# EAGLE design TCGaugeAmplifier (EAGLE 9.6.2)
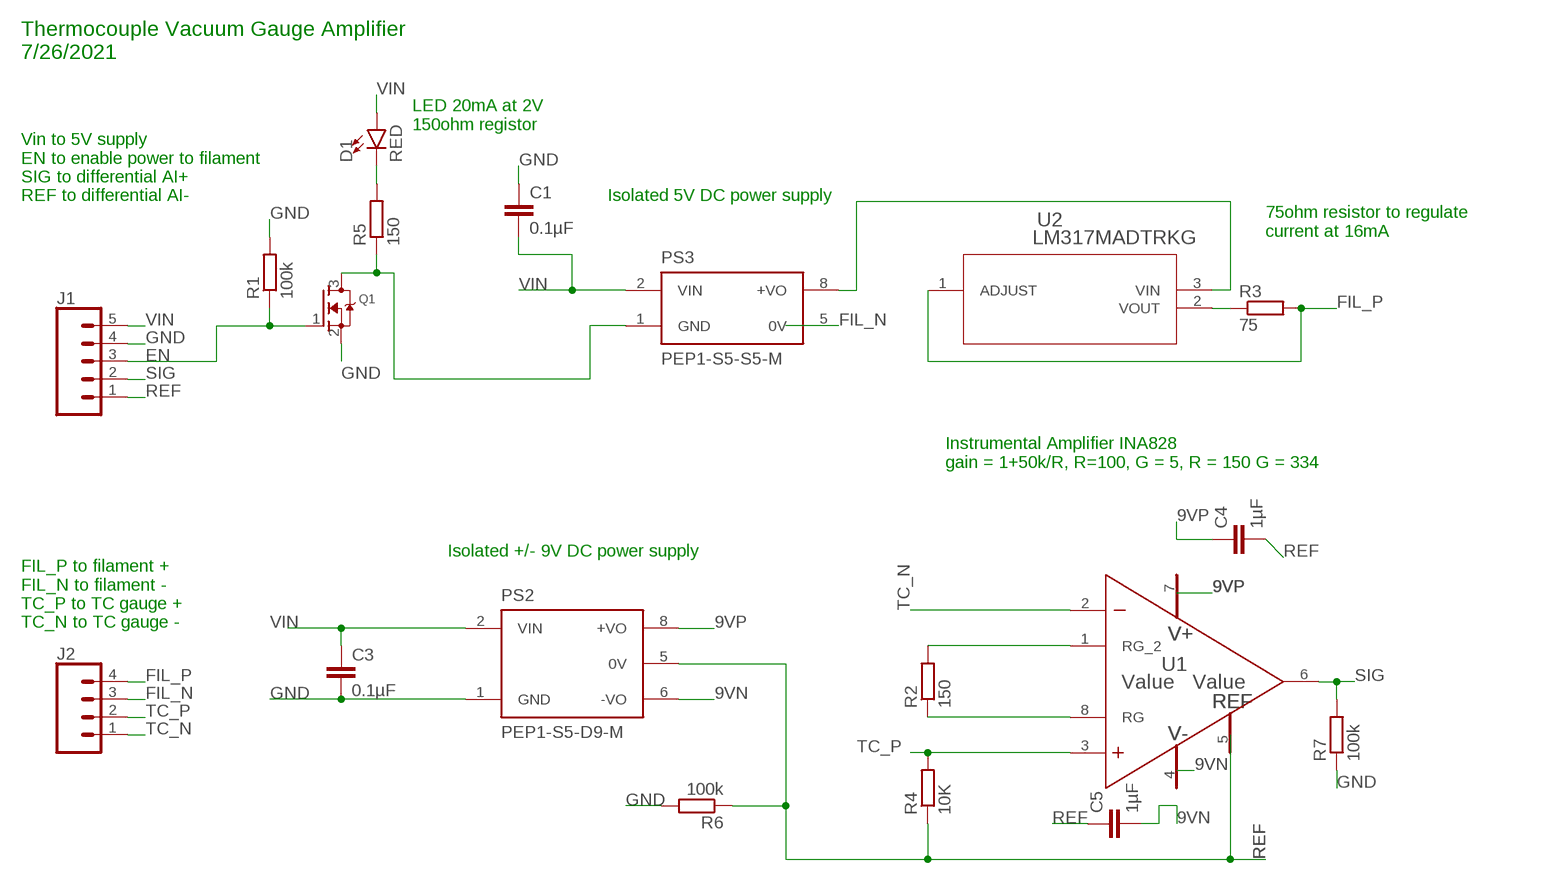
[diagram p0: schematic, sheet 1]

## Parts
C1  0.1µF  0.33UF/330NF-0805-50V-10%  [0805]
C3  0.1µF  0.33UF/330NF-0805-50V-10%  [0805]
C4  1µF  0.33UF/330NF-0805-50V-10%  [0805]
C5  1µF  0.33UF/330NF-0805-50V-10%  [0805]
D1  RED  LED-RED0603  [LED-0603]
J1  CONN_05  [1X05]
J2  CONN_04  [1X04]
PS2  PEP1-S5-D9-M  [CONV_PEP1-S5-D9-M]
PS3  PEP1-S5-S5-M  [CONV_PEP1-S5-S5-M]
Q1  MOSFET-NREFLOW  [SOT23]
R1  100k  R-EU_R0805  [R0805]
R2  150  R-EU_R0805  [R0805]
R3  75  R-EU_R0805  [R0805]
R4  10K  R-EU_R0805  [R0805]
R5  150  R-EU_R0805  [R0805]
R6  100k  R-EU_R0805  [R0805]
R7  100k  R-EU_R0805  [R0805]
U1  Value  INA828IDR  [D0008A_N]
U2  LM317MADTRKG  [DPAK-3_ONS]

## Nets
9VN: C5.2 PS2.6(-VO) U1.4(V-)
9VP: C4.1 PS2.8(+VO) U1.7(V+)
EN: J1.3 Q1.1(G) R1.1
FIL_N: J2.3 PS3.5(0V)
FIL_P: J2.4 R3.2 U2.1(ADJUST)
GND: C1.1 C3.2 J1.4 PS2.1(GND) Q1.2(S) R1.2 R6.2 R7.1
N$1: R2.2 U1.1(RG_2)
N$2: R2.1 U1.8(RG)
N$3: PS3.8(+VO) U2.3(VIN)
N$4: R3.1 U2.2(VOUT)
N$7: D1.C R5.2
N$8: PS3.1(GND) Q1.3(D) R5.1
REF: C4.2 C5.1 J1.1 PS2.5(0V) R4.1 R6.1 U1.5(REF)
SIG: J1.2 R7.2 U1.6(OUT)
TC_N: J2.1 U1.2(IN-)
TC_P: J2.2 R4.2 U1.3(IN+)
VIN: C1.2 C3.1 D1.A J1.5 PS2.2(VIN) PS3.2(VIN)

## Notes on the sheet
- Thermocouple Vacuum Gauge Amplifier
  7/26/2021
- LED 20mA at 2V
  150ohm registor
- Vin to 5V supply
  EN to enable power to filament
  SIG to differential AI+
  REF to differential AI-
- Isolated 5V DC power supply
- 75ohm resistor to regulate 
  current at 16mA
- Instrumental Amplifier INA828
  gain = 1+50k/R, R=100, G = 5, R = 150 G = 334
- Isolated +/- 9V DC power supply
- FIL_P to filament +
  FIL_N to filament -
  TC_P to TC gauge +
  TC_N to TC gauge -

## Library data of the parts
C1 C3-C5 = SparkFun-Capacitors:0.33UF/330NF: 0.33µF/330nF ceramic capacitors A capacitor is a passive two-terminal electrical component used to store electrical energy temporarily in an electric field.; PROD_ID: CAP-08469; VALUE: 0.33µF
D1 = SparkFun-LED:LED-RED: Red SMD LED Used in manufacturing of most products at SparkFun Packages: 0603 - SMD 0603 package [Product Link] <http://docs.avagotech.com/docs/AV02-0551EN> 0603 SMART - SMD 0603 SMART package ( more efficient and expensive)[Product Link] <http://www.osram-os.com/Graphics/XPic2/00077099_0.pdf> 1206 - SMD1206 package [Product Link] <https://www.sparkfun.com/datasheets/DevTools/LilyPad/Q150OVS4.pdff> SparkFun Products: Pro Mini 328 -5V <https://www.sparkfun.com/products/821> RedBoard <https://www.sparkfun.com/products/12757> IOIO-OTG <https://www.sparkfun.com/products/13613>; PROD_ID: DIO-00819
J1 = SparkFun-Connectors:CONN_05: Multi connection point. Often used as Generic Header-pin footprint for 0.1 inch spaced/style header connections On any of the 0.1 inch spaced packages, you can populate with these: Break Away Headers - Straight <https://www.sparkfun.com/products/116> (PRT-00116) Break Away Male Headers - Right Angle <https://www.sparkfun.com/products/553> (PRT-00553) Female Headers <https://www.sparkfun.com/products/115> (PRT-00115) Break Away Headers - Machine Pin <https://www.sparkfun.com/products/117> (PRT-00117) Break Away Female Headers - Swiss Machine Pin <https://www.sparkfun.com/products/743> (PRT-00743) For SCREWTERMINALS and SPRING TERMINALS visit here: Screw Terimnals on SparkFun.com <https://www.sparkfun.com/search/results?term=Screw+Terminals> (5mm/3.5mm/2.54mm spacing) This device is also useful as a general connection point to wire up your design to another part of your project. Our various solder wires solder well into these plated through hole pads. Hook-Up Wire - Assortment (Stranded, 22 AWG) <https://www.sparkfun.com/products/11375> (PRT-11375) Hook-Up Wire - Assortment (Solid Core, 22 AWG) <https://www.sparkfun.com/products/11367> (PRT-11367) View the entire wire category on our website here <https://www.sparkfun.com/categories/141> Special notes: Molex polarized connector foot print use with SKU : PRT-08231 with associated crimp pins and housings. 1MM SMD Version SKU: PRT-10208
J2 = SparkFun-Connectors:CONN_04: Multi connection point. Often used as Generic Header-pin footprint for 0.1 inch spaced/style header connections On any of the 0.1 inch spaced packages, you can populate with these: Break Away Headers - Straight <https://www.sparkfun.com/products/116> (PRT-00116) Break Away Male Headers - Right Angle <https://www.sparkfun.com/products/553> (PRT-00553) Female Headers <https://www.sparkfun.com/products/115> (PRT-00115) Break Away Headers - Machine Pin <https://www.sparkfun.com/products/117> (PRT-00117) Break Away Female Headers - Swiss Machine Pin <https://www.sparkfun.com/products/743> (PRT-00743) For SCREWTERMINALS and SPRING TERMINALS visit here: Screw Terimnals on SparkFun.com <https://www.sparkfun.com/search/results?term=Screw+Terminals> (5mm/3.5mm/2.54mm spacing) This device is also useful as a general connection point to wire up your design to another part of your project. Our various solder wires solder well into these plated through hole pads. Hook-Up Wire - Assortment (Stranded, 22 AWG) <https://www.sparkfun.com/products/11375> (PRT-11375) Hook-Up Wire - Assortment (Solid Core, 22 AWG) <https://www.sparkfun.com/products/11367> (PRT-11367) View the entire wire category on our website here <https://www.sparkfun.com/categories/141> Special notes: Molex polarized connector foot print use with SKU : PRT-08231 with associated crimp pins and housings. 1MM SMD Version SKU: PRT-10208; PROD_ID: CONN-09696
PS2 = PEP1-S5-D9-M:PEP1-S5-D9-M; MANUFACTURER: CUI Inc.; MAXIMUM_PACKAGE_HEIGHT: 7.25mm; PARTREV: 1.0; STANDARD: Manufacturer Recommendations
PS3 = PEP1-S5-S5-M:PEP1-S5-S5-M; MANUFACTURER: CUI Inc.; MAXIMUM_PACKAGE_HEIGHT: 7.25mm; PARTREV: 1.0; STANDARD: Manufacturer Recommendations
Q1 = adafruit:MOSFET-N: N-Channel Mosfet 2N7002E - 60V 260mA SOT23 [Digikey: 2N7002ET1GOSTR-ND] - REEL BSH103 - 30V 850mA SOT23 [Digikey: 568-5013-1-ND]
R1-R7 = rcl:R-EU_: RESISTOR, European symbol; SPICEPREFIX: R
U1 = INA828:INA828IDR; MANUFACTURER: Texas Instruments; PARTNUMBER: INA828IDR; REFDES: RefDes; TYPE: TYPE
U2 = LM317:LM317MADTRKG: LM317; COPYRIGHT: Copyright (C) 2016 Accelerated Designs. All rights reserved; MANUFACTURER_PART_NUMBER: LM317MADTRKG; SOURCELIBRARY: ONSemi_2017-12-12_3; VENDOR: ON Semiconductor

## Board
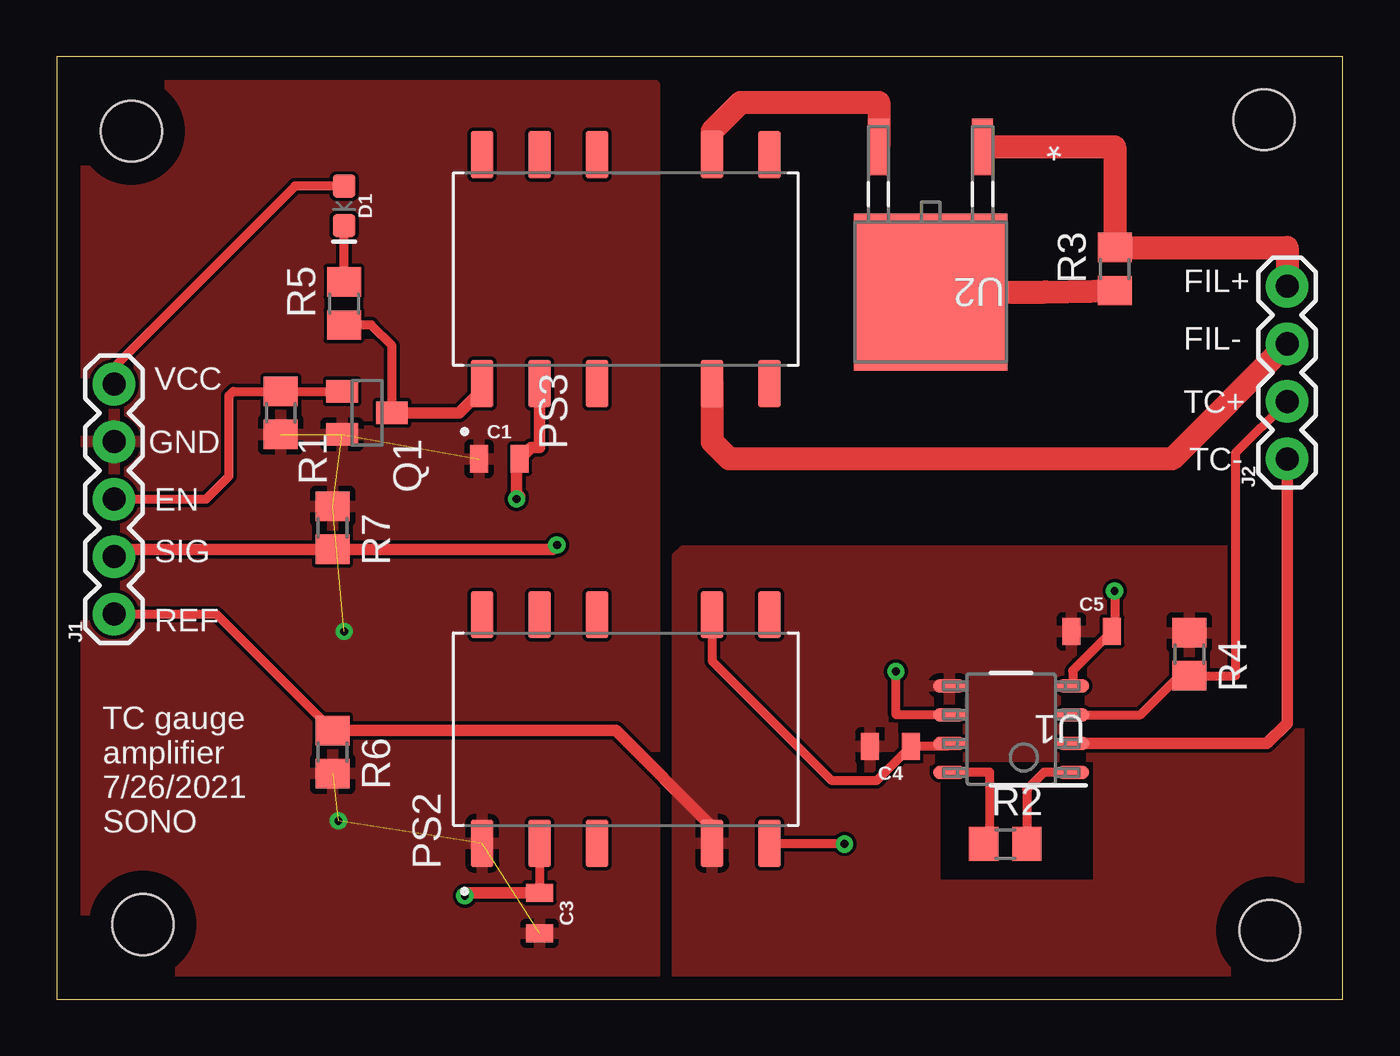
[diagram p1: board, top side]
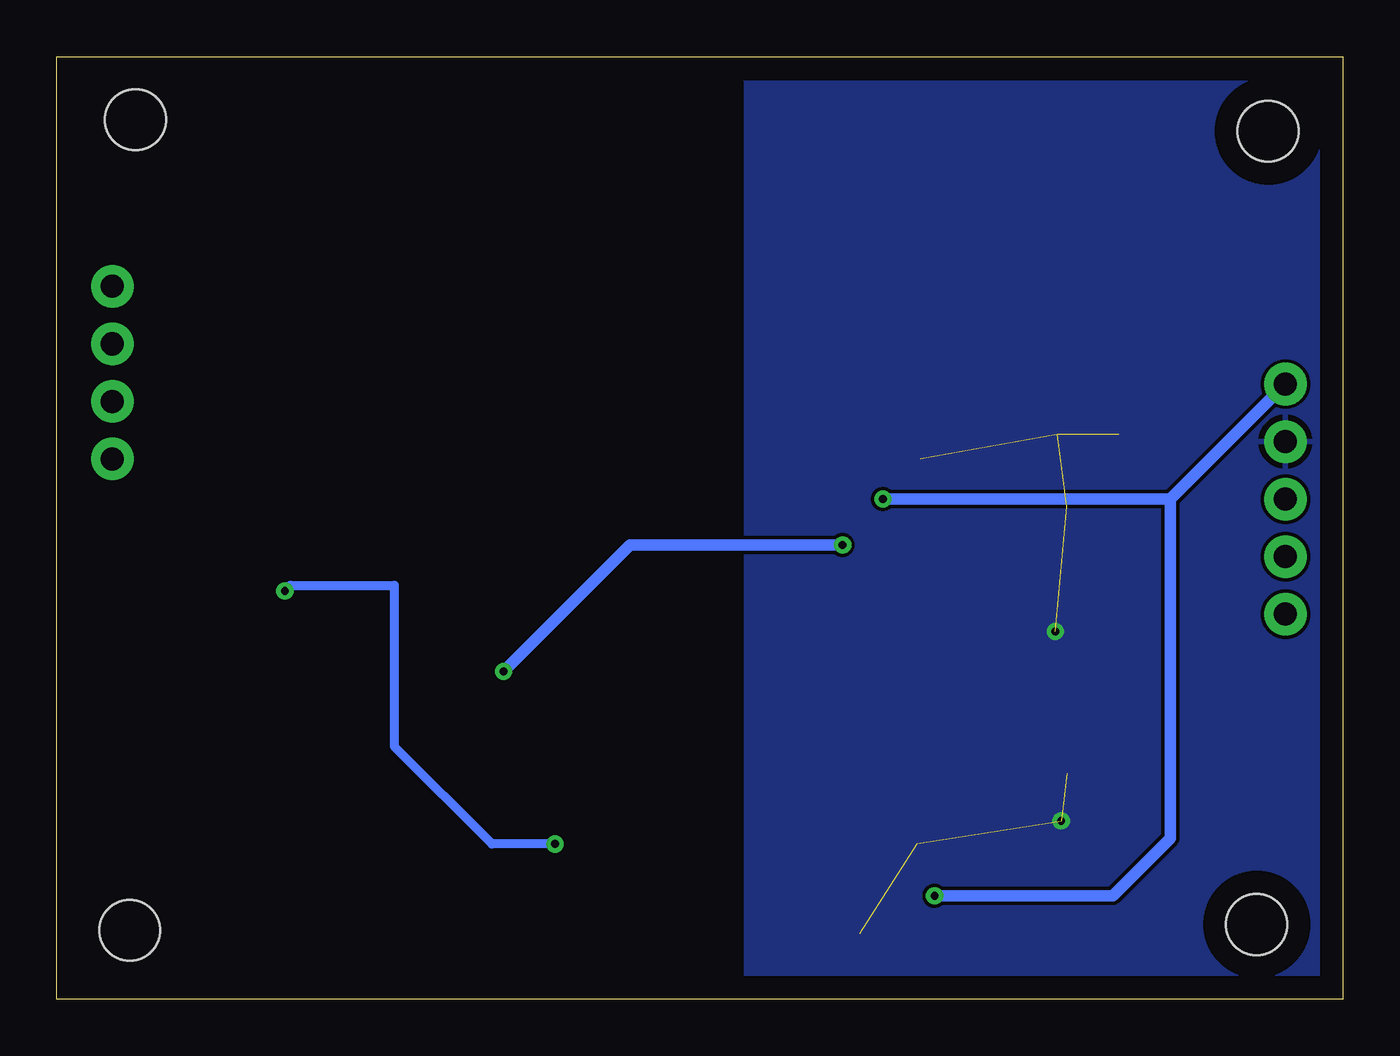
[diagram p2: board, bottom side, seen from below]

Size 56.82 x 41.65 mm. Coordinates in mm from the lower left corner, seen from the top.
Outline: 0,0 56.82,0 56.82,41.65 0,41.65 0,0
Copper layers (1*16): Top 0.035mm / dielectric 1.5mm / Bottom 0.035mm
Design rules "default": minimum track width 6mil, minimum drill 0.35mm, track to track 6mil, track to pad 6mil, pad to pad 6mil, via to via 6mil, smd to smd 6mil, copper to edge 40mil, drill to drill 6mil, minimum pad ring 10mil, minimum via ring 8mil, stop-mask expansion 4mil, vias tented up to drill 0mil, thermal gap 10mil
Holes 2.69 mm at 3.3,38.35 53.34,38.86 53.59,3.05 3.81,3.3

### Footprints (pad centres in the part's own frame; a part is rotated, then mirrored left to right if it is on the bottom)
0805 = smd 0.8 x 1.2: 1 -0.9,0; 2 0.9,0
LED-0603 = smd 1 x 1: A -0.877,0; C 0.877,0
1X05 = drill 1.016 pad 1.88: 1 0,0; 2 2.54,0; 3 5.08,0; 4 7.62,0; 5 10.16,0
1X04 = drill 1.016 pad 1.88: 1 0,0; 2 2.54,0; 3 5.08,0; 4 7.62,0
CONV_PEP1-S5-D9-M = smd 2.1 x 1: 1 -5.05,6.35; 2 -5.05,3.81; 3 -5.05,1.27; 5 -5.05,-3.81; 6 -5.05,-6.35; 7 5.05,-6.35; 8 5.05,-3.81; 10 5.05,1.27; 11 5.05,3.81; 12 5.05,6.35
CONV_PEP1-S5-S5-M = smd 2.1 x 1: 1 -5.05,6.35; 2 -5.05,3.81; 3 -5.05,1.27; 5 -5.05,-3.81; 6 -5.05,-6.35; 7 5.05,-6.35; 8 5.05,-3.81; 10 5.05,1.27; 11 5.05,3.81; 12 5.05,6.35
SOT23 = smd 1 x 1.4: 1 -0.95,-1.1; 2 0.95,-1.1; 3 0,1.1
R0805 = smd 1.3 x 1.5: 1 -0.95,0; 2 0.95,0
D0008A_N = smd 1.45 x 0.6: 1 -2.725,1.905; 2 -2.725,0.635; 3 -2.725,-0.635; 4 -2.725,-1.905; 5 2.725,-1.905; 6 2.725,-0.635; 7 2.725,0.635; 8 2.725,1.905
DPAK-3_ONS = smd 0.94 x 2.489: 1 -2.29,-6.413; 3 2.29,-6.413 | smd 6.782 x 6.934: 2 0,0

### Placement (x,y rotation side)
C1  19.56,23.88 0 top
C3  21.34,3.81 270 top
C4  36.83,11.18 180 top
C5  45.72,16.26 0 top
D1  12.7,35.05 270 top
J1  2.54,17.02 90 top
J2  54.36,23.88 90 top
PS2  25.15,11.94 90 top
PS3  25.15,32.26 90 top
Q1  13.72,25.91 270 top
R1  9.91,25.91 270 top
R2  41.91,6.86 0 top
R3  46.74,32.26 90 top
R4  50.04,15.24 270 top
R5  12.7,30.73 90 top
R6  12.19,10.92 270 top
R7  12.19,20.83 270 top
U1  42.16,11.94 180 top
U2  38.61,31.24 180 top

### Tracks (layer width: path | path; a pad name or v marks a point on that pad's centre or on a via)
9VN  (via drill 0.35)
  Top 0.406: U1.4 44.89,14.53 C5.2 46.74,16.37 v46.74,18.03 | v34.8,6.86 31.53,6.86 PS2.6
  Bottom 0.406: v46.74,18.03 46.48,18.29 41.91,18.29 41.91,11.18 37.59,6.86 v34.8,6.86
9VP
  Top 0.406: PS2.8 28.96,14.96 34.26,9.65 36.21,9.65 C4.1 39.31,11.18 U1.7
CUTOUT
  cutout Top: 39.12,10.41 45.72,10.41 45.72,5.33 39.12,5.33
EN
  Top 0.406: J1.3 6.6,22.1 7.62,23.11 7.62,26.67 7.81,26.86 R1.1 Q1.1
FIL_N
  Top 1.016: PS3.5 28.96,24.64 29.72,23.88 49.28,23.88 J2.3
FIL_P
  Top 1.016: U2.1 46.74,37.66 R3.2 54.36,33.21 J2.4
GND  (via drill 0.35)  (7 unrouted)
  other vias: 12.45,7.87 12.7,16.26
  pour Top: 1.27,40.39 26.42,40.39 26.42,0.76 26.16,0.51 1.02,0.51 1.02,40.13
  pour Bottom: 0.51,40.64 26.42,40.64 26.42,0.25 0.76,0.25 0.51,0.51
N$1
  Top 0.406: U1.1 43.62,10.03 42.86,9.27 R2.2
N$2
  Top 0.406: R2.1 41.21,7.11 41.21,10.03 U1.8
N$3
  Top 0.508: PS3.8 28.96,38.35
  Top 1.016: 28.96,38.35 30.23,39.62 36.32,39.62 U2.3
N$4
  Top 1.016: U2.2 43.69,31.24 R3.1
N$7
  Top 0.406: R5.2 D1.C
N$8
  Top 0.406: Q1.3 14.82,28.87 13.9,29.78 R5.1
  Top 0.508: 18.54,26.67 18.66,26.55 | Q1.3 17.78,25.91 18.29,26.42 18.54,26.67 | PS3.1 18.8,26.92 18.54,26.67
REF
  Top 0.406: J1.1 7.05,17.02 R6.1
  Top 0.508: R6.1 24.7,11.87 28.96,7.62 PS2.5
  pour Top: 27.43,19.56 27.43,0.25 54.61,0.25 54.86,0.51 54.86,19.56 54.61,19.81 27.69,19.81
SIG  (via drill 0.35)
  Top 0.406: U1.6 37.08,12.57 v37.08,14.48 | 12.2,20.07 R7.2
  Top 0.508: J1.2 2.86,19.88 R7.2 21.91,19.88 v22.1,20.07
  Bottom 0.508: v37.08,14.48 31.5,20.07 v22.1,20.07
TC_N
  Top 0.508: U1.2 53.47,11.3 54.36,12.19 J2.1
TC_P
  Top 0.406: U1.3 47.88,12.57 49.6,14.29 R4.2 52.07,14.29 52.07,24.13 J2.2
VIN  (via drill 0.35)
  Top 0.406: PS2.2 C3.1 | D1.A 10.53,35.93 2.54,27.94 J1.5
  Top 0.508: v18.03,4.57 18.17,4.71 C3.1 | PS3.2 21.34,24.38 20.97,24.38 C1.2 20.32,23.74 v20.32,22.1 20.46,22.24
  Bottom 0.508: J1.5 7.62,22.1 | 7.62,22.1 7.62,7.11 10.16,4.57 v18.03,4.57 | 7.62,22.1 v20.32,22.1

### Text on the board
tNames: FIL+ | FIL- | VCC | TC+ | GND | TC- | EN | SIG | REF | TC gauge / amplifier / 7/26/2021 / SONO